# Altium schematic sheet AUAV-X1_UARTS_R1.SchDoc
size A4; PageSetup: Record=PageOptions|CenterHorizontal=True|CenterVertical=True|PrintScale=0.97|XCorrection=1.00|YCorrection=1.00|PrintKind=2|BorderSize=5000000|LeftOffset=0|BottomOffset=0|Orientation=2|PaperLength=1000|PaperWidth=1000|Scale=100|PaperSource=267|PrintQuality=-4|MediaType=1|DitherType=1|PaperKind=A4|PrintScaleMode=1
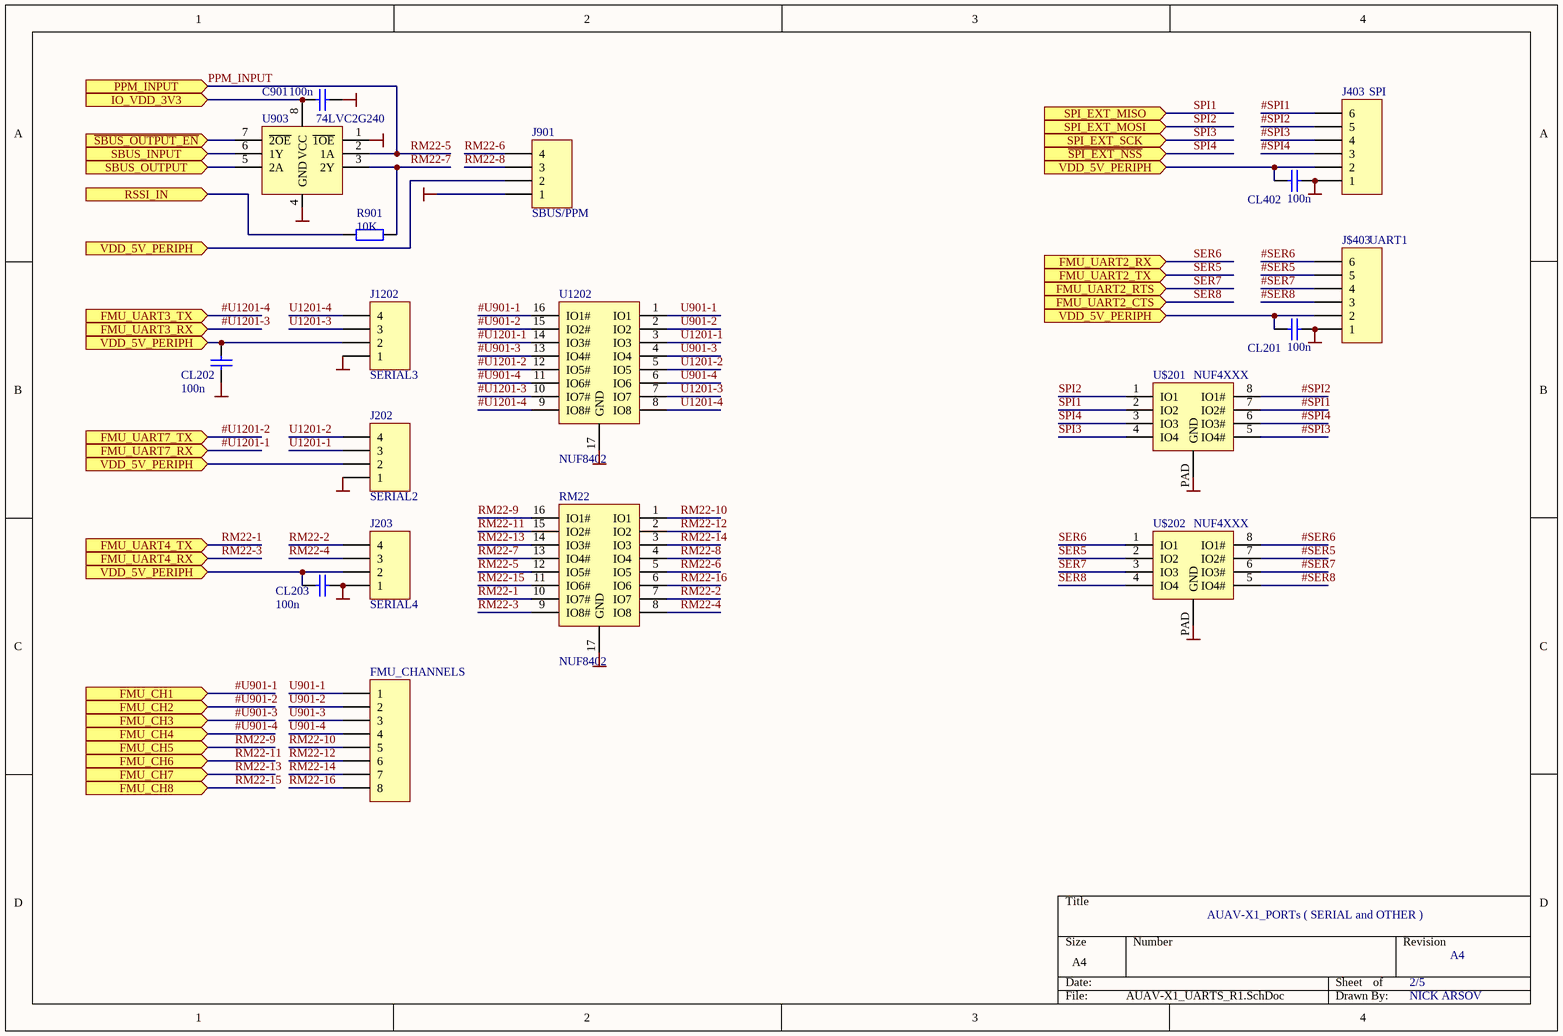
[diagram p0: AUAV-X1_UARTS_R1.SchDoc]

## Parts
C901  100n  [0402A]
CL201  100n  [0402A]
CL202  100n  [0402A]
CL203  100n  [0402A]
CL402  100n  [0402A]
FMU_CHANNELS  Header 8  [HDR1X8]  (value not drawn)
J202  SERIAL2  [HDR1X4]
J203  SERIAL4  [HDR1X4]
J403  SPI  [2mm_con_2x3]
J901  SBUS/PPM  [HDR1X4]
J1202  SERIAL3  [HDR1X4]
J$403  UART1  [2mm_con_2x3]
R901  10K  [0402A]
RM22  NUF8402  [NUF8402]
U903  74LVC2G240  [VSON8]
U1202  NUF8402  [NUF8402]
U$201  NUF4XXX  [NUF4211]
U$202  NUF4XXX  [NUF4211]

## Ports
FMU_CH1, FMU_CH2, FMU_CH3, FMU_CH4, FMU_CH5, FMU_CH6, FMU_CH7, FMU_CH8, FMU_UART2_CTS, FMU_UART2_RTS, FMU_UART2_RX, FMU_UART2_TX, FMU_UART3_RX, FMU_UART3_TX, FMU_UART4_RX, FMU_UART4_TX, FMU_UART7_RX, FMU_UART7_TX, IO_VDD_3V3, PPM_INPUT, RSSI_IN, SBUS_INPUT, SBUS_OUTPUT, SPI_EXT_MISO, SPI_EXT_MOSI, SPI_EXT_SCK, VDD_5V_PERIPH, ~{SBUS_OUTPUT_EN}, ~{SPI_EXT_NSS}

## Nets
GND: C901.2 CL201.2 CL202.2 CL203.2 CL402.2 J202.1 J203.1 J403.1 J901.1 J1202.1 J$403.1 RM22.17(GND) U903.1(~{1OE}) U903.4(GND) U1202.17(GND) U$201.PAD(GND) U$202.PAD(GND)
#SER5: J$403.5 U$202.7(IO2#)
#SER6: J$403.6 U$202.8(IO1#)
#SER7: J$403.4 U$202.6(IO3#)
#SER8: J$403.3 U$202.5(IO4#)
#SPI1: J403.6 U$201.7(IO2#)
#SPI2: J403.5 U$201.8(IO1#)
#SPI3: J403.4 U$201.5(IO4#)
#SPI4: J403.3 U$201.6(IO3#)
#U901-1: U1202.16(IO1#) ; port FMU_CH1
#U901-2: U1202.15(IO2#) ; port FMU_CH2
#U901-3: U1202.13(IO4#) ; port FMU_CH3
#U901-4: U1202.11(IO6#) ; port FMU_CH4
#U1201-1: U1202.14(IO3#) ; port FMU_UART7_RX
#U1201-2: U1202.12(IO5#) ; port FMU_UART7_TX
#U1201-3: U1202.10(IO7#) ; port FMU_UART3_RX
#U1201-4: U1202.9(IO8#) ; port FMU_UART3_TX
~{SBUS_OUTPUT_EN}: U903.7(~{2OE}) ; port ~{SBUS_OUTPUT_EN}
IO_VDD_3V3: C901.1 U903.8(VCC) ; port IO_VDD_3V3
PPM_INPUT: RM22.12(IO5#) U903.2(1A) ; port PPM_INPUT  [also labelled RM22-5]
RM22-1: RM22.10(IO7#) ; port FMU_UART4_TX
RM22-2: J203.4 RM22.7(IO7)
RM22-3: RM22.9(IO8#) ; port FMU_UART4_RX
RM22-4: J203.3 RM22.8(IO8)
RM22-6: J901.4 RM22.5(IO5)
RM22-7: R901.1 RM22.13(IO4#) U903.3(2Y)
RM22-8: J901.3 RM22.4(IO4)
RM22-9: RM22.16(IO1#) ; port FMU_CH5
RM22-10: FMU_CHANNELS.5 RM22.1(IO1)
RM22-11: RM22.15(IO2#) ; port FMU_CH6
RM22-12: FMU_CHANNELS.6 RM22.2(IO2)
RM22-13: RM22.14(IO3#) ; port FMU_CH7
RM22-14: FMU_CHANNELS.7 RM22.3(IO3)
RM22-15: RM22.11(IO6#) ; port FMU_CH8
RM22-16: FMU_CHANNELS.8 RM22.6(IO6)
RSSI_IN: R901.2 ; port RSSI_IN
SBUS_INPUT: U903.6(1Y) ; port SBUS_INPUT
SBUS_OUTPUT: U903.5(2A) ; port SBUS_OUTPUT
SER5: U$202.2(IO2) ; port FMU_UART2_TX
SER6: U$202.1(IO1) ; port FMU_UART2_RX
SER7: U$202.3(IO3) ; port FMU_UART2_RTS
SER8: U$202.4(IO4) ; port FMU_UART2_CTS
SPI1: U$201.2(IO2) ; port SPI_EXT_MISO
SPI2: U$201.1(IO1) ; port SPI_EXT_MOSI
SPI3: U$201.4(IO4) ; port SPI_EXT_SCK
SPI4: U$201.3(IO3) ; port ~{SPI_EXT_NSS}
U901-1: FMU_CHANNELS.1 U1202.1(IO1)
U901-2: FMU_CHANNELS.2 U1202.2(IO2)
U901-3: FMU_CHANNELS.3 U1202.4(IO4)
U901-4: FMU_CHANNELS.4 U1202.6(IO6)
U1201-1: J202.3 U1202.3(IO3)
U1201-2: J202.4 U1202.5(IO5)
U1201-3: J1202.3 U1202.7(IO7)
U1201-4: J1202.4 U1202.8(IO8)
VDD_5V_PERIPH: CL201.1 CL202.1 CL203.1 CL402.1 J202.2 J203.2 J403.2 J901.2 J1202.2 J$403.2 ; port VDD_5V_PERIPH

## Notes on the sheet
- AUAV-X1_PORTs ( SERIAL and OTHER )
- 2/5
- A4
- NICK ARSOV

## Library data of the parts
C901 CL201-CL203 CL402 = Cap: Capacitor; Value: 100pF; Published: 8-Jun-2000; LatestRevisionDate: 17-Jul-2002; LatestRevisionNote: Re-released for DXP Platform.; PackageReference: RAD-0.3; Publisher: Altium Limited
FMU_CHANNELS = Header 8: Header, 8-Pin; LatestRevisionDate: 17-Jul-2002; LatestRevisionNote: Re-released for DXP Platform.; Publisher: Altium Limited
J202 J203 J901 J1202 = Header 4: Header, 4-Pin; LatestRevisionDate: 17-Jul-2002; LatestRevisionNote: Re-released for DXP Platform.; Publisher: Altium Limited
J403 J$403 = Header 6: Header, 6-Pin; LatestRevisionDate: 17-Jul-2002; LatestRevisionNote: Re-released for DXP Platform.; Publisher: Altium Limited
R901 = Res2: Resistor; Value: 1K; Published: 8-Jun-2000; LatestRevisionDate: 17-Jul-2002; LatestRevisionNote: Re-released for DXP Platform.; PackageReference: AXIAL-0.4; Publisher: Altium Limited